# Altium schematic sheet Power Generation - Buck Converter.SchDoc: [5] Power Generation - Buck Converter
size A3; ApprovedBy: Nagy Richard; CheckedBy: Nagy Richard; Author: Nagy Richard; CompanyName: EmbedCore; DrawnBy: Nagy Richard; Engineer: Nagy Richard; Revision: 1.0; SheetNumber: 5; SheetTotal: 25
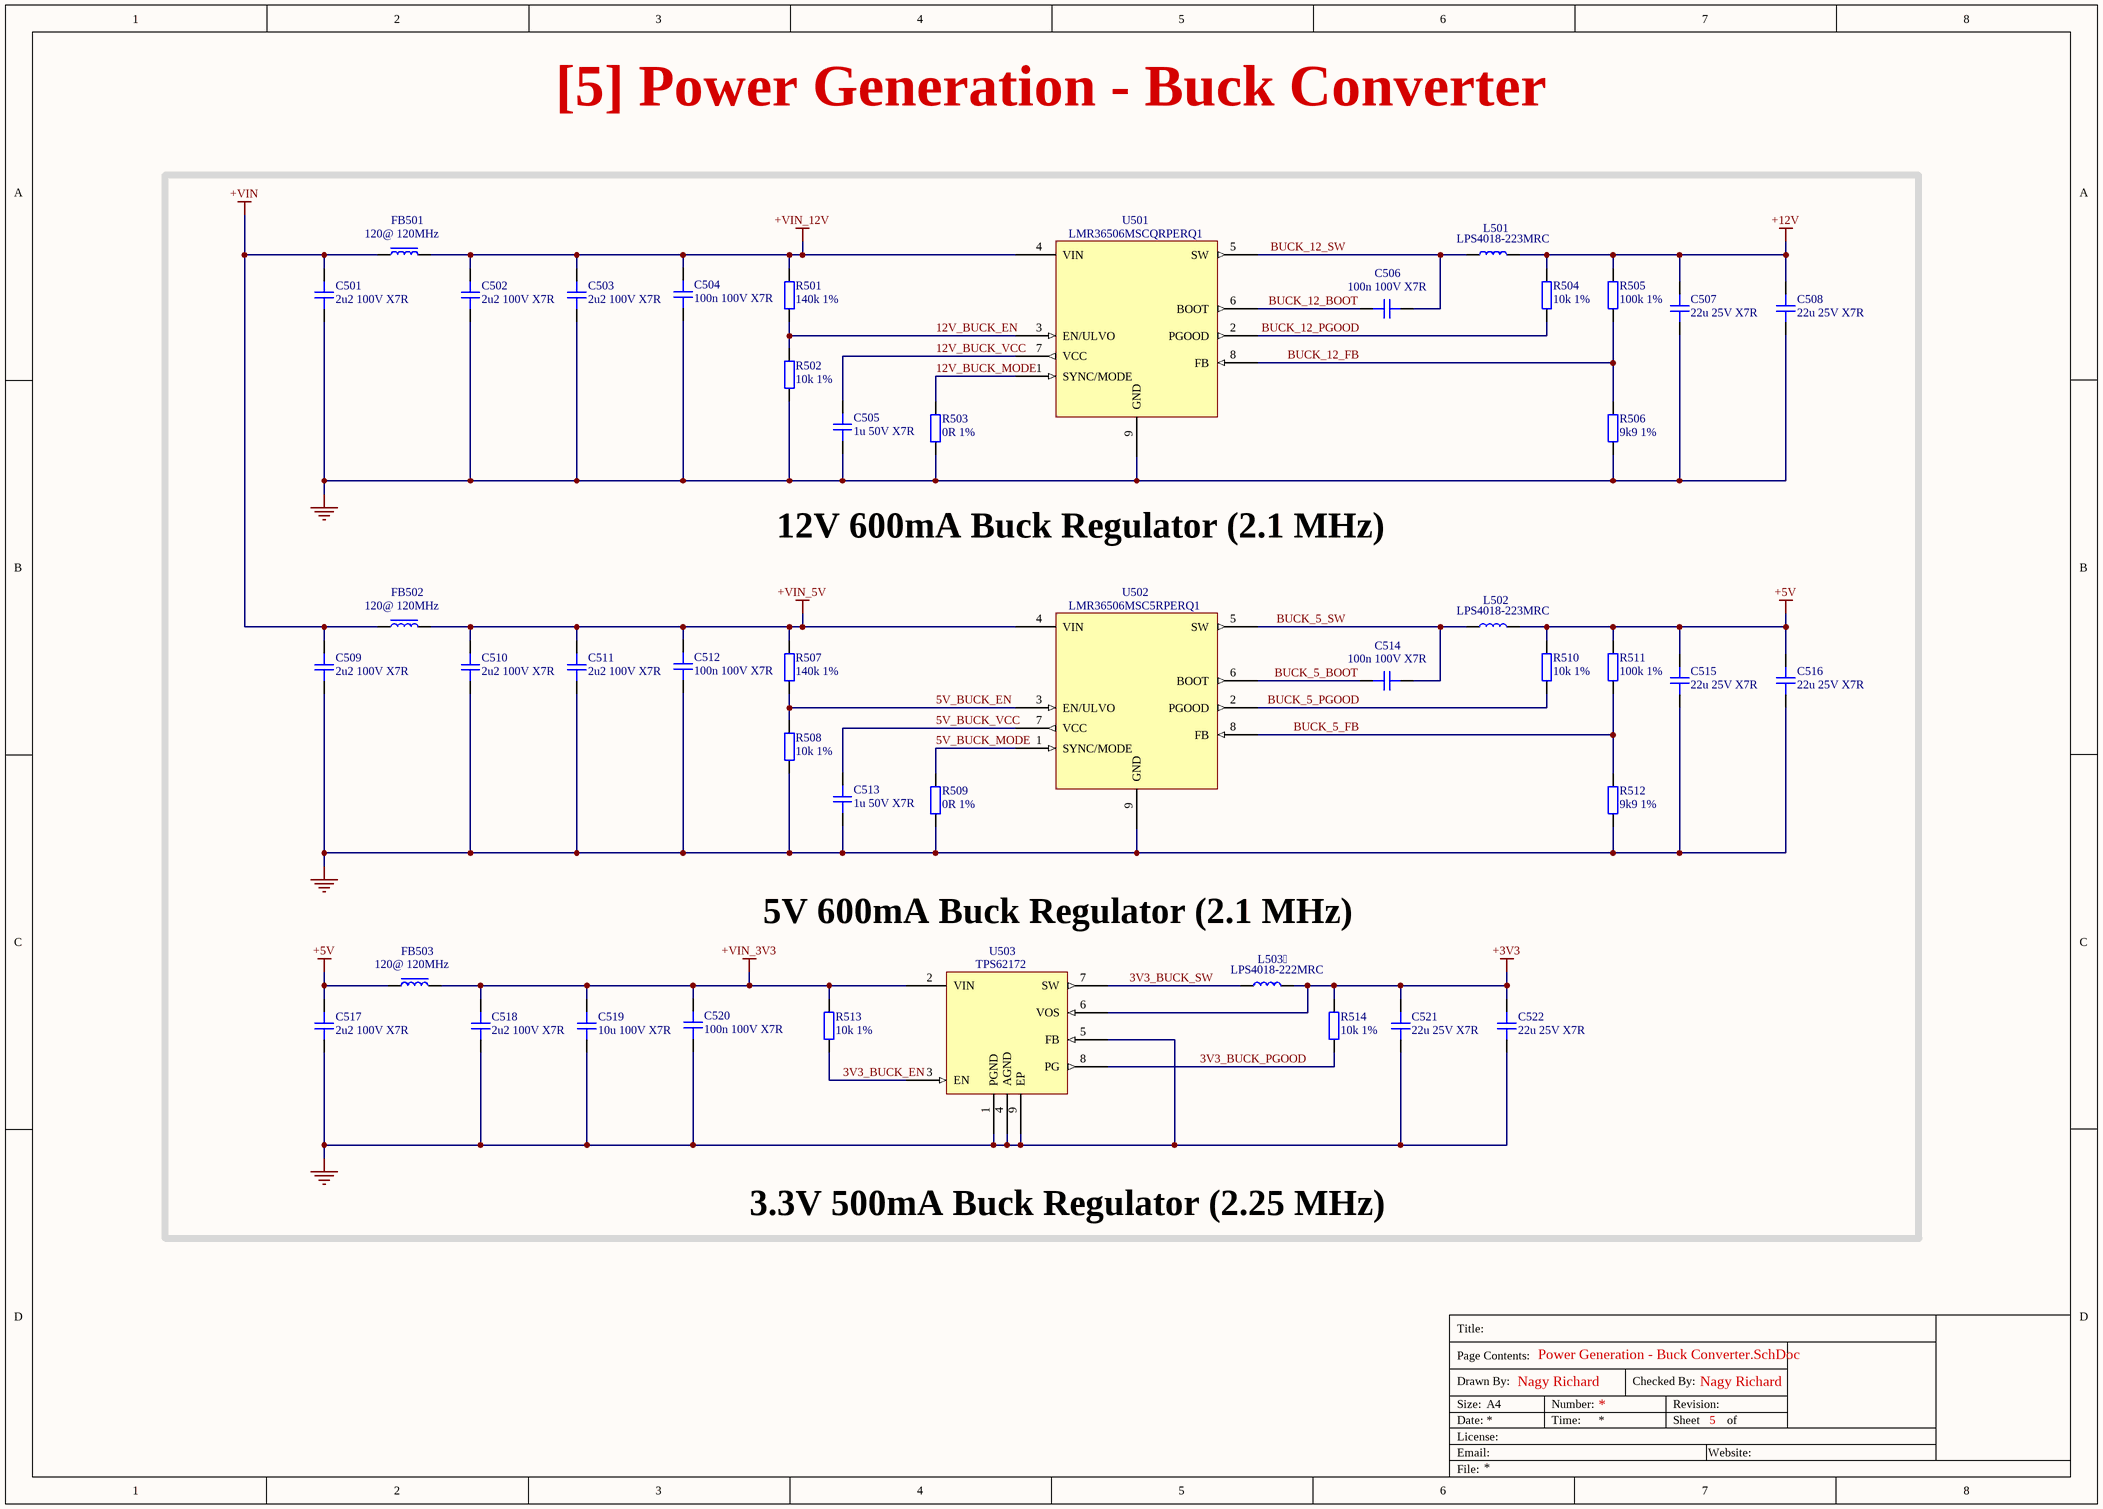
[diagram p0: Power Generation - Buck Converter.SchDoc]

## Parts
C501  2u2 100V X7R  [CAP_1210]
C502  2u2 100V X7R  [CAP_1210]
C503  2u2 100V X7R  [CAP_1210]
C504  100n 100V X7R  [CAP_0805]
C505  1u 50V X7R  [CAP_0603]
C506  100n 100V X7R  [CAP_0805]
C507  22u 25V X7R  [CAP_1210]
C508  22u 25V X7R  [CAP_1210]
C509  2u2 100V X7R  [CAP_1210]
C510  2u2 100V X7R  [CAP_1210]
C511  2u2 100V X7R  [CAP_1210]
C512  100n 100V X7R  [CAP_0805]
C513  1u 50V X7R  [CAP_0603]
C514  100n 100V X7R  [CAP_0805]
C515  22u 25V X7R  [CAP_1210]
C516  22u 25V X7R  [CAP_1210]
C517  2u2 100V X7R  [CAP_1210]
C518  2u2 100V X7R  [CAP_1210]
C519  10u 100V X7R  [CAP_1210]
C520  100n 100V X7R  [CAP_0805]
C521  22u 25V X7R  [CAP_1210]
C522  22u 25V X7R  [CAP_1210]
FB501  120@ 120MHz  [FB_0805]
FB502  120@ 120MHz  [FB_0805]
FB503  120@ 120MHz  [FB_0805]
L501  LPS4018-223MRC  [LPS4018]
L502  LPS4018-223MRC  [LPS4018]
L503  LPS4018-222MRC  [LPS4018]
R501  140k 1%  [RES_0603]
R502  10k 1%  [RES_0603]
R503  0R 1%  [RES_0603]
R504  10k 1%  [RES_0603]
R505  100k 1%  [RES_0603]
R506  9k9 1%  [RES_0603]
R507  140k 1%  [RES_0603]
R508  10k 1%  [RES_0603]
R509  0R 1%  [RES_0603]
R510  10k 1%  [RES_0603]
R511  100k 1%  [RES_0603]
R512  9k9 1%  [RES_0603]
R513  10k 1%  [RES_0603]
R514  10k 1%  [RES_0603]
U501  LMR36506MSCQRPERQ1  [LMR36506MSC5RPERQ1]
U502  LMR36506MSC5RPERQ1  [LMR36506MSC5RPERQ1]
U503  TPS62172  [SON50P200X200X80-9N]

## Nets
+3V3: C521.2 C522.2 L503.2 R514.2 U503.6(VOS)
+5V: C515.2 C516.2 C517.2 FB503.1 L502.2 R510.2 R511.2
+12V: C507.2 C508.2 L501.2 R504.2 R505.2
+VIN: C501.2 C509.2 FB501.1 FB502.1
+VIN_3V3: C518.2 C519.2 C520.2 FB503.2 R513.2 U503.2(VIN)
+VIN_5V: C510.2 C511.2 C512.2 FB502.2 R507.2 U502.4(VIN)
+VIN_12V: C502.2 C503.2 C504.2 FB501.2 R501.2 U501.4(VIN)
GND: C501.1 C502.1 C503.1 C504.1 C505.1 C507.1 C508.1 C509.1 C510.1 C511.1 C512.1 C513.1 C515.1 C516.1 C517.1 C518.1 C519.1 C520.1 C521.1 C522.1 R502.1 R503.1 R506.1 R508.1 R509.1 R512.1 U501.9(GND) U502.9(GND) U503.1(PGND) U503.4(AGND) U503.5(FB) U503.9(EP)
3V3_BUCK_EN: R513.1 U503.3(EN)
3V3_BUCK_PGOOD: R514.1 U503.8(PG)
3V3_BUCK_SW: L503.1 U503.7(SW)
5V_BUCK_EN: R507.1 R508.2 U502.3(EN/ULVO)
5V_BUCK_MODE: R509.2 U502.1(SYNC/MODE)
5V_BUCK_VCC: C513.2 U502.7(VCC)
12V_BUCK_EN: R501.1 R502.2 U501.3(EN/ULVO)
12V_BUCK_MODE: R503.2 U501.1(SYNC/MODE)
12V_BUCK_VCC: C505.2 U501.7(VCC)
BUCK_5_BOOT: C514.2 U502.6(BOOT)
BUCK_5_FB: R511.1 R512.2 U502.8(FB)
BUCK_5_PGOOD: R510.1 U502.2(PGOOD)
BUCK_5_SW: C514.1 L502.1 U502.5(SW)
BUCK_12_BOOT: C506.2 U501.6(BOOT)
BUCK_12_FB: R505.1 R506.2 U501.8(FB)
BUCK_12_PGOOD: R504.1 U501.2(PGOOD)
BUCK_12_SW: C506.1 L501.1 U501.5(SW)

## Notes on the sheet
- 12V 600mA Buck Regulator (2.1 MHz)
- 5V 600mA Buck Regulator (2.1 MHz)
- 3.3V 500mA Buck Regulator (2.25 MHz)
- Title:
- Drawn By:
- Page Contents:
- Checked By:
- Size:
- Date:
- File:
- License:
- Email:
- A4
- Number:
- Time:
- Revision:
- Sheet
- Website:
- of

## Library data of the parts
C501-C503 C509-C511 C517 C518 = CAP_1210: Capacitor SMD 1210; Manufacturer: Taiyo Yuden; Manufacturer Part Number: HMK325B7225KM-P; Distributor Link: www.lcsc.com; LCSC: C385983; Rating: *; Dielectric: *
C504 C506 C512 C514 C520 = CAP_0805: Capacitor SMD 0805; Manufacturer: HUI JU; Manufacturer Part Number: NM0805B104K101CEDN; Distributor Link: www.lcsc.com; LCSC: C710457; Rating: *; Dielectric: *
C505 C513 = CAP_0603: Capacitor SMD 0603; Manufacturer: YAGEO; Manufacturer Part Number: CC0603KRX7R9BB105; Distributor Link: www.lcsc.com; LCSC: C559769; Rating: *; Dielectric: *
C507 C508 C515 C516 C521 C522 = CAP_1210: Capacitor SMD 1210; Manufacturer: Samwha Capacitor; Manufacturer Part Number: CS3225X7R226K250NRL; Distributor Link: www.lcsc.com; LCSC: C2918511; Rating: *; Dielectric: *
C519 = CAP_1210: Capacitor SMD 1210; Manufacturer: PSA(Prosperity Dielectrics); Manufacturer Part Number: FS32X106K101EGG; Distributor Link: www.lcsc.com; LCSC: C5156756; Rating: *; Dielectric: *
FB501-FB503 = FB_0805: Ferrite Bead SMD 0805; Manufacturer: Murata Electronics; Manufacturer Part Number: BLM21AG121SN1D; Distributor Link: www.lcsc.com; LCSC: C88990
L501 L502 L503 = LPS4018: Shielded Power Inductors – LPS4018
R501 R502 R504 R507 R508 R510 R513 R514 = RES_0603: Resistor SMD 0603; Manufacturer: YAGEO; Manufacturer Part Number: RC0603FR-07140KL; Distributor Link: www.lcsc.com; LCSC: C185372
R503 R509 = RES_0603: Resistor SMD 0603; Manufacturer: YAGEO; Manufacturer Part Number: AC0603FR-070RL; Distributor Link: www.lcsc.com; LCSC: C116699
R505 R511 = RES_0603: Resistor SMD 0603; Manufacturer: YAGEO; Manufacturer Part Number: RC0603FR-07100KL; Distributor Link: www.lcsc.com; LCSC: C14675
R506 R512 = RES_0603: Resistor SMD 0603; Manufacturer: TBD; Manufacturer Part Number: TBD; Distributor Link: www.lcsc.com; LCSC: TBD
U501 U502 = LMR36506MSC5RPERQ1: LMR36506-Q1 3-V to 65-V, 0.6-A Synchronous Buck Converter Optimized for Size and / Light Load Efficiency / 5V Output
U503 = TPS62172: TPS6217x-Q1 3-V to17-V 0.5-A Step-Down Converters with DCS-Control™